# EAGLE design x9c (EAGLE 9.6.2)
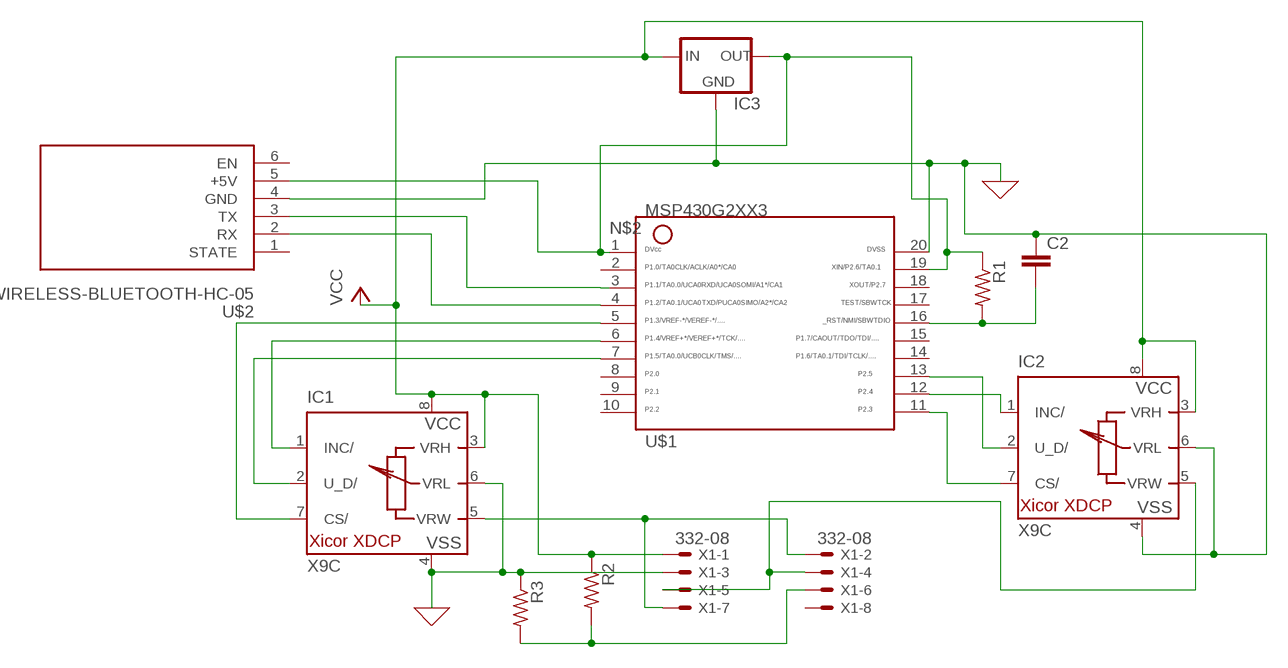
[diagram p0: schematic, sheet 1]

## Parts
C2  C2,5-3  [C2.5-3]
IC1  X9C  [DIL08]
IC2  X9C  [DIL08]
IC3  78MXXL  [78MXXL]
R1  R-US_0204/5  [0204/5]
R2  R-US_0204/5  [0204/5]
R3  R-US_0204/5  [0204/5]
U$1  G2XX3---N20  [N20]
U$2  WIRELESS-BLUETOOTH-HC-05  [WIRELESS-BLUETOOTH-HC-05]
X1  332-08  [332-08]

## Nets
0 [Ground]: C2.1 IC1.4(VSS) IC1.6(VRL) IC2.4(VSS) IC2.6(VRL) IC3.GND R3.1 U$1.20 U$2.4(GND) X1.3 ; supply symbol labelled GND
N$1: U$1.4 U$2.2(RX)
N$2: IC3.OUT R1.1 U$1.1 U$1.19 U$2.5(+5V)
N$3: U$1.3 U$2.3(TX)
N$4: IC1.7(CS/) U$1.5
N$5: IC1.1(INC/) U$1.6
N$6: IC1.2(U_D/) U$1.7
N$7: C2.2 R1.2 U$1.16
N$8: IC2.7(CS/) U$1.11
N$9: IC2.1(INC/) U$1.12
N$10: IC2.2(U_D/) U$1.13
N$13: IC1.5(VRW) X1.2 X1.7
N$14: IC2.5(VRW) X1.4 X1.5
N$16: R2.2 R3.2 X1.6
VCC: IC1.3(VRH) IC1.8(VCC) IC2.3(VRH) IC2.8(VCC) IC3.IN R2.1 X1.1
Unconnected: U$1.2 U$1.8 U$1.9 U$1.10 U$1.14 U$1.15 U$1.17 U$1.18 U$2.1(STATE) U$2.6(EN) X1.8

## Library data of the parts
C2 = capacitor-wima:C: CAPACITOR naming: grid - package width
IC1 IC2 = xicor-eepot:X9C*: Xicor Digitally controlled Potentiometer (EEPOT) by Xicor (now at www.intersil.com)
IC3 = v-reg:78MXXL: VOLTAGE REGULATOR
R1-R3 = rcl:R-US_: RESISTOR, American symbol; SPICEPREFIX: R
U$1 = TI_MSP430_v16:G2XX3---N20: MSP430G2XX1 PDIP (N) 20 Pin Package
U$2 = diy-modules:WIRELESS-BLUETOOTH-HC-05: Bluetooth Transceiver Module based on HC-05 board Tutorial is available here: https://arduino-info.wikispaces.com/BlueTooth-HC05-HC06-Modules-How-To Click here to find device on ebay.com <http://www.ebay.com/sch/hc-05+module+rs232>
X1 = con-garry:332-08: 8 Pin - 2mm Dual Row Source: www.mpe-connector.de / garry_shortform_2012.pdf

## Net classes
0 default: width 0.61 mm
1 Ground: width 0.813 mm

## Board
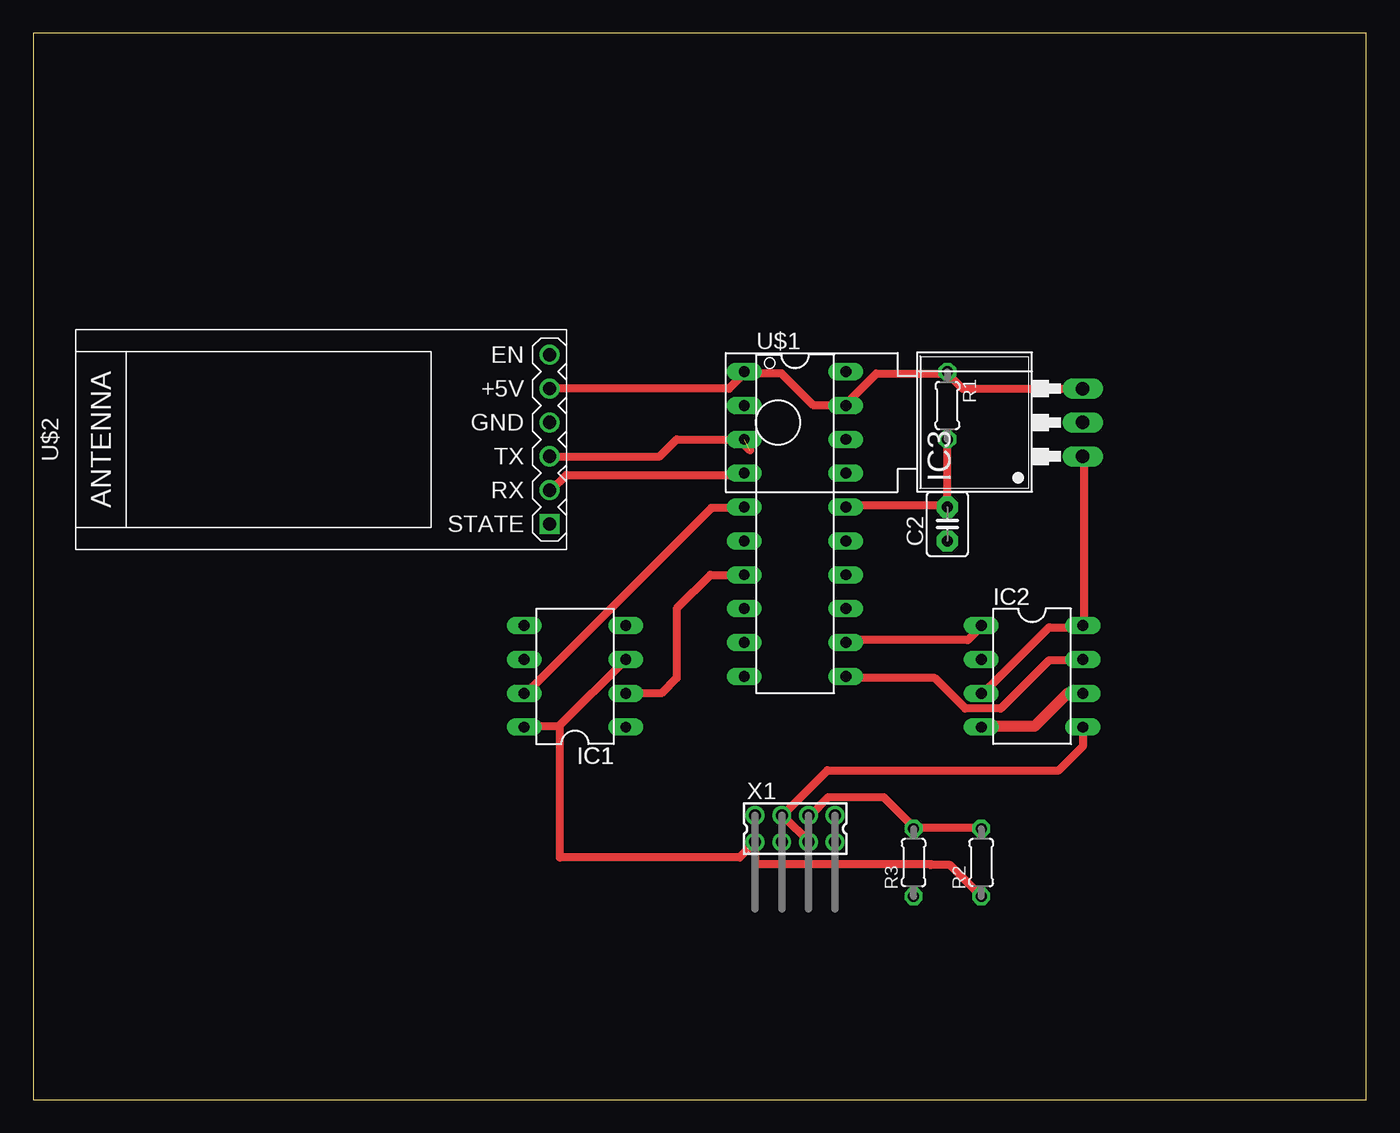
[diagram p1: board, top side]
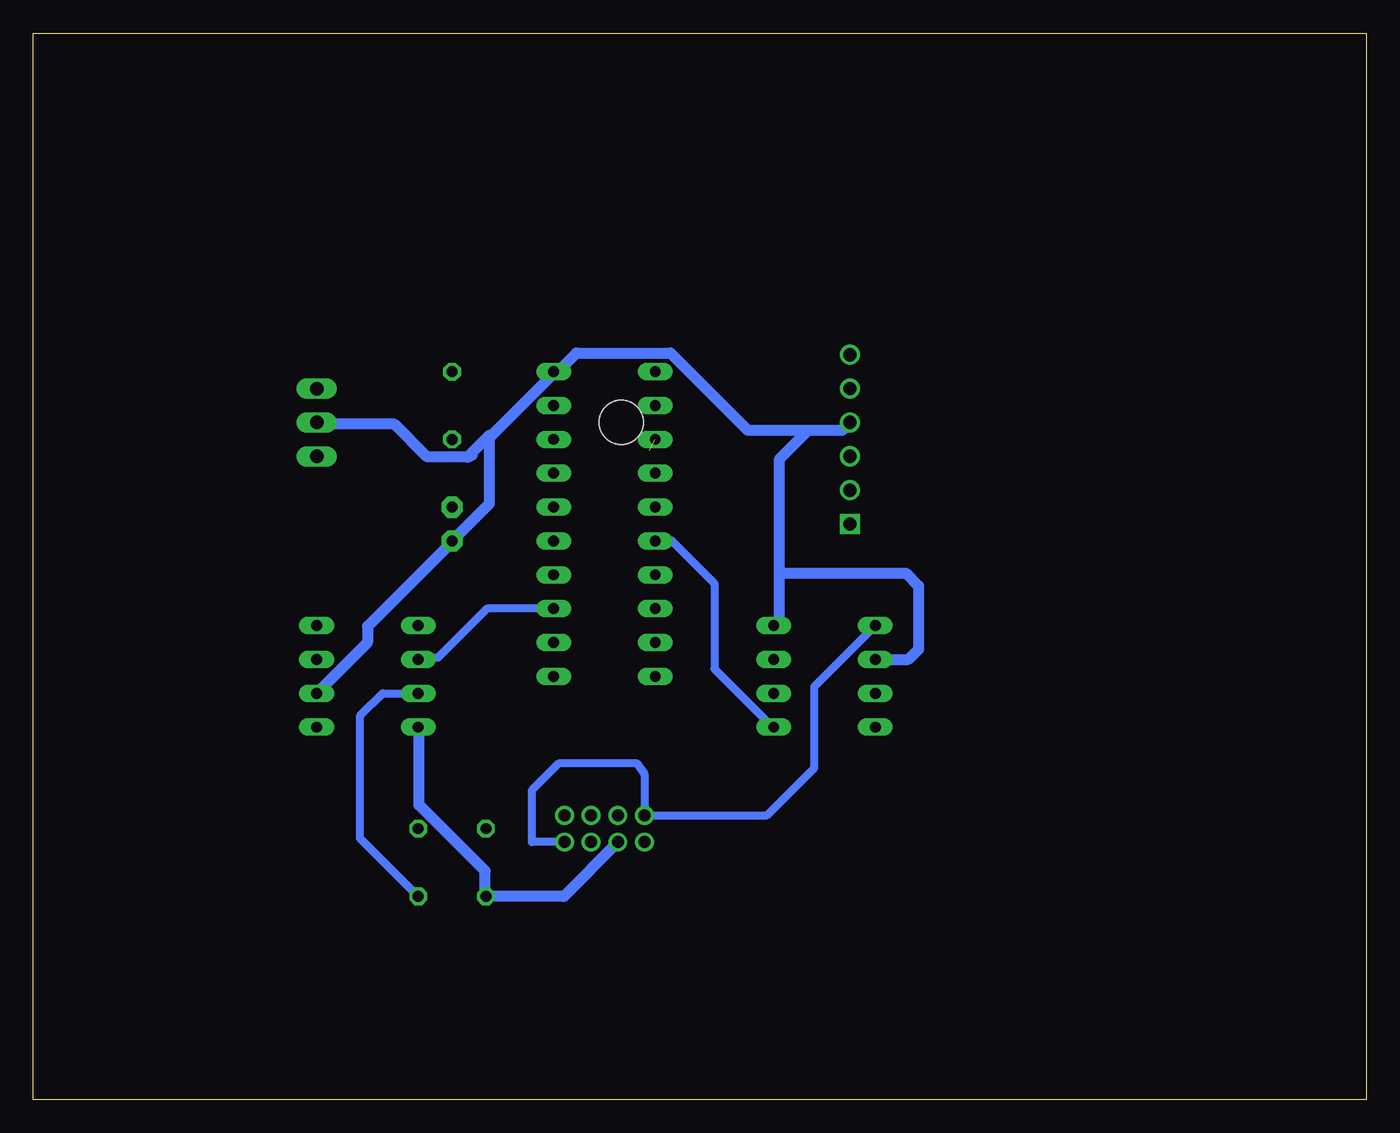
[diagram p2: board, bottom side, seen from below]

Size 100 x 80 mm. Coordinates in mm from the lower left corner, seen from the top.
Outline: 0,0 100,0 100,80 0,80 0,0
Copper layers (1*16): Top 0.035mm / dielectric 1.5mm / Bottom 0.035mm
Design rules "default": minimum track width 6mil, minimum drill 0.35mm, track to track 6mil, track to pad 6mil, pad to pad 6mil, via to via 6mil, smd to smd 6mil, copper to edge 40mil, drill to drill 6mil, minimum pad ring 10mil, minimum via ring 8mil, stop-mask expansion 4mil, vias tented up to drill 0mil, thermal gap 10mil

### Footprints (pad centres in the part's own frame; a part is rotated, then mirrored left to right if it is on the bottom)
C2.5-3 = drill 0.813 pad 1.6 octagon: 1 -1.27,0; 2 1.27,0
DIL08 = drill 0.813 long: 1 -3.81,-3.81; 2 -1.27,-3.81; 3 1.27,-3.81; 4 3.81,-3.81; 5 3.81,3.81; 6 1.27,3.81; 7 -1.27,3.81; 8 -3.81,3.81
78MXXL = drill 1.016 long: GND 0,-5.08; IN -2.54,-5.08; OUT 2.54,-5.08 | hole 3.302: 0,17.78
0204/5 = drill 0.813 octagon: 1 -2.54,0; 2 2.54,0
N20 = drill 0.813 long: 1 -11.435,-3.81; 2 -8.895,-3.81; 3 -6.355,-3.81; 4 -3.815,-3.81; 5 -1.275,-3.81; 6 1.265,-3.81; 7 3.805,-3.81; 8 6.345,-3.81; 9 8.885,-3.81; 10 11.425,-3.81; 11 11.425,3.81; 12 8.885,3.81; 13 6.345,3.81; 14 3.805,3.81; 15 1.265,3.81; 16 -1.275,3.81; 17 -3.815,3.81; 18 -6.355,3.81; 19 -8.895,3.81; 20 -11.435,3.81
WIRELESS-BLUETOOTH-HC-05 = drill 1 square: 1 -6.35,-17.145 | drill 1: 2 -3.81,-17.145; 3 -1.27,-17.145; 4 1.27,-17.145; 5 3.81,-17.145; 6 6.35,-17.145
332-08 = drill 0.9 pad 1.27: 1 -3,-1; 2 -3,1; 3 -1,-1; 4 -1,1; 5 1,-1; 6 1,1; 7 3,-1; 8 3,1

### Placement (x,y rotation side)
C2  68.58,43.18 90 top
IC1  40.64,31.75 90 top
IC2  74.93,31.75 270 top
IC3  73.66,50.8 90 top
R1  68.58,52.07 270 top
R2  71.12,17.78 90 top
R3  66.04,17.78 90 top
U$1  57.15,43.18 270 top
U$2  21.59,49.53 90 top
X1  57.15,20.32 0 top

### Tracks (layer width: path | path; a pad name or v marks a point on that pad's centre or on a via)
0
  Top 0.813: IC2.6 77.6,30.48 75.12,28 71.25,28 IC2.4
  Bottom 0.813: X1.3 56.2,19.24 60.2,15.24 R3.1 66.1,15.62 66.1,17.14 71.06,22.1 71.06,27.81 IC2.4 | IC1.6 34.35,33.02 33.59,33.78 33.59,38.54 34.54,39.5 44.01,39.5 | 44.01,39.5 44.01,36.01 IC1.4 | 41.85,50.23 44.01,48.07 44.01,39.5 | U$2.4 39.31,50.23 41.85,50.23 | 67.44,48.2 65.79,49.85 65.79,49.66 | 65.79,49.66 60.96,54.48 U$1.20 60.58,54.67 59.24,56.01 52.2,56.01 46.42,50.23 41.85,50.23 | 65.79,49.66 65.79,44.7 C2.1 68.52,41.91 74.93,35.5 74.93,34.29 IC2.6 | IC3.GND 78.68,50.67 72.9,50.67 70.45,48.22 67.38,48.22 67.06,48.39
N$1
  Top 0.61: U$1.4 53.34,46.86 40.01,46.86 38.86,45.72 U$2.2
N$2
  Top 0.61: U$2.5 52.2,53.34 53.15,54.29 U$1.1 53.34,54.48 56.13,54.48 58.54,52.08 U$1.19 61.15,52.39 63.25,54.48 68.58,54.48 R1.1 68.77,54.29 69.72,53.34 IC3.OUT
N$3  (1 unrouted)
  Top 0.61: U$2.3 46.99,48.26 48.26,49.53 52.95,49.53 53.78,48.7
N$4
  Top 0.61: IC1.7 36.96,30.48 50.86,44.39 53.34,44.39 U$1.5
N$5
  Bottom 0.61: U$1.6 52.08,41.91 48.9,38.73 48.9,32.32 44.58,28 IC1.1
N$6
  Top 0.61: IC1.2 47.12,30.48 48.26,31.62 48.26,36.84 50.8,39.38 U$1.7
N$7
  Top 0.61: U$1.16 60.96,44.58 68.58,44.58 C2.2 R1.2
N$8
  Top 0.61: U$1.11 60.96,31.62 67.63,31.62 69.91,29.34 72.58,29.34 76.2,32.96 78.68,32.96 IC2.7
N$9
  Top 0.61: U$1.12 60.96,34.48 70.1,34.48 71.06,35.43 IC2.1
N$10
  Bottom 0.61: U$1.13 65.97,36.84 69.66,33.15 71.06,33.15 IC2.2
N$13
  Bottom 0.61: IC1.5 41.4,30.99 41.4,24.89 44.96,21.34 54.1,21.34 X1.2 54.15,24.43 54.69,25.21 60.58,25.21 62.61,23.18 62.61,19.32 X1.7
N$14
  Top 0.61: IC2.5 78.74,26.48 76.96,24.7 59.56,24.7 56.2,21.34 X1.4 56.39,21.14 58.1,19.43 X1.5
N$16
  Top 0.61: R2.2 71.06,20.38 66.1,20.38 R3.2 65.91,20.57 63.82,22.67 59.63,22.67 58.29,21.34 X1.6
VCC
  Top 0.61: IC1.3 39.5,28.07 | 39.5,28.07 39.5,18.16 52.99,18.16 X1.1 54.15,17.65 67.37,17.65 67.31,17.59 68.77,17.59 R2.1 | 39.5,28.07 39.43,28 36.96,28 IC1.8 | IC2.3 71.25,30.48 76.2,35.43 78.68,35.43 IC2.8 78.87,35.81 78.87,48.2 IC3.IN
  Bottom 0.61: R2.1 75.5,19.62 75.5,28.77 73.79,30.48 IC2.3